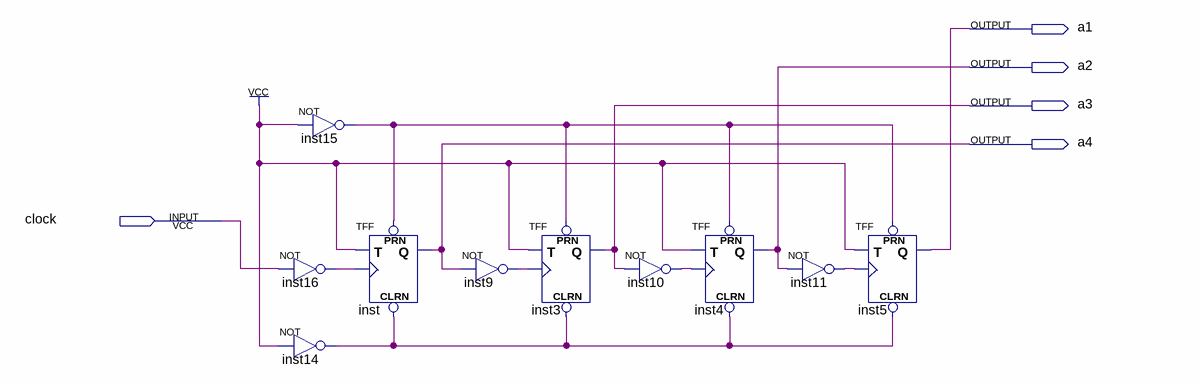
[diagram p0: schematic sheet]
// Quartus schematic OneDigitCounter.bdf as structural Verilog: 10 symbols, 5 pins
module OneDigitCounter (
  input  clock,
  output a1,
  output a2,
  output a3,
  output a4
);

  wire inst9_out, inst10_out, inst11_out, inst14_out, inst15_out, inst16_out;

  not inst16 (inst16_out, clock);
  not inst14 (inst14_out, 1'b1);
  not inst15 (inst15_out, 1'b1);
  TFF inst (.PRN(inst15_out), .CLRN(inst14_out), .T(1'b1), .CLK(inst16_out), .Q(a4));
  not inst9 (inst9_out, a4);
  TFF inst3 (.PRN(inst15_out), .CLRN(inst14_out), .T(1'b1), .CLK(inst9_out), .Q(a3));
  not inst10 (inst10_out, a3);
  TFF inst4 (.PRN(inst15_out), .CLRN(inst14_out), .T(1'b1), .CLK(inst10_out), .Q(a2));
  not inst11 (inst11_out, a2);
  TFF inst5 (.PRN(inst15_out), .CLRN(inst14_out), .T(1'b1), .CLK(inst11_out), .Q(a1));
endmodule
